# EAGLE schematic Arduino robot (EAGLE 9.4.2)
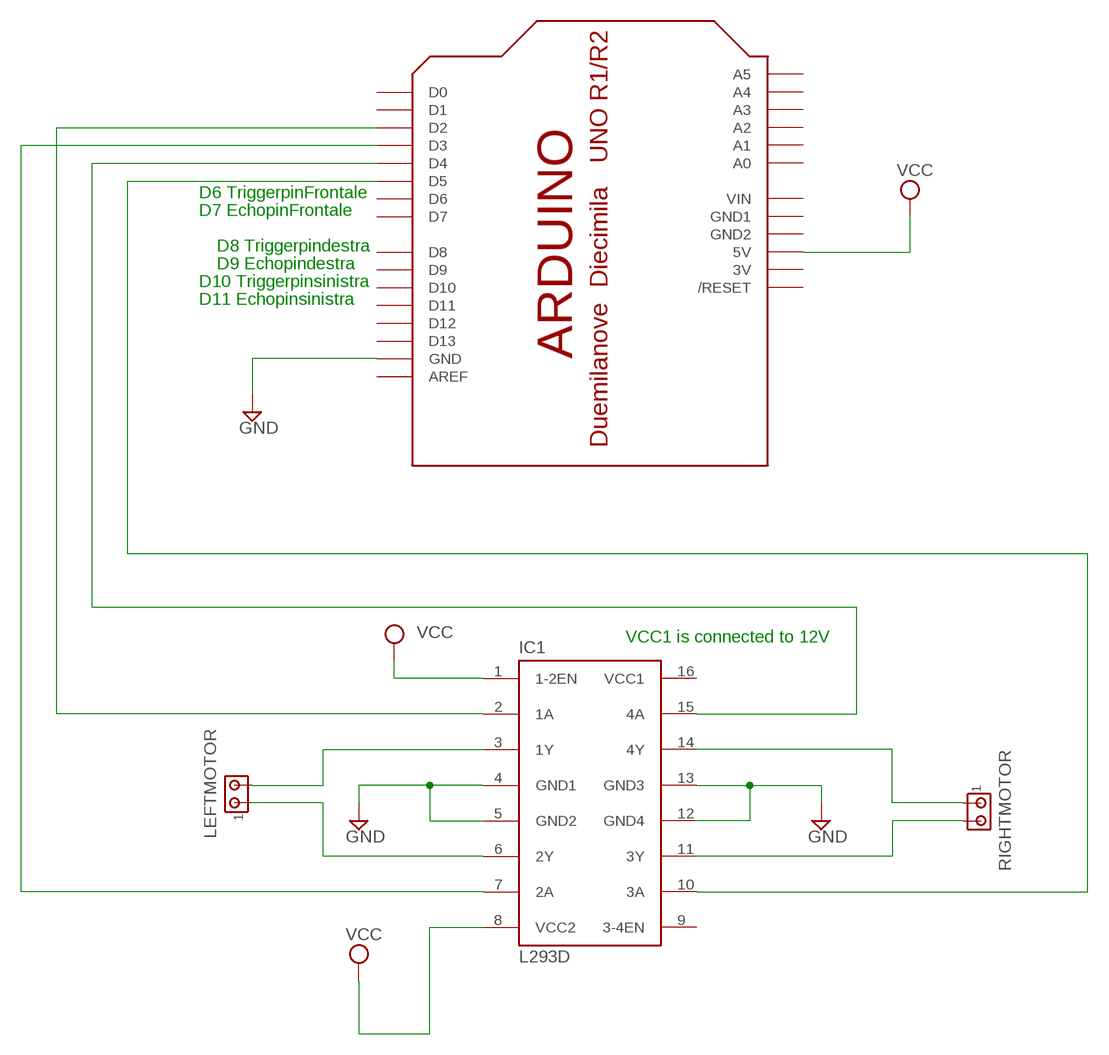
[diagram p0: schematic, sheet 1]

## Parts
IC1  L293D  [DIL16]
LEFTMOTOR  MTA02-156  [1X2MTA]
RIGHTMOTOR  MTA02-156  [1X2MTA]
U$1  ARDUINO-NOHOLE  [ARDUINO-NOHOLE]

## Nets
GND: IC1.4(GND1) IC1.5(GND2) IC1.12(GND4) IC1.13(GND3) U$1.GND
N$1: IC1.3(1Y) LEFTMOTOR.2
N$2: IC1.6(2Y) LEFTMOTOR.1
N$3: IC1.14(4Y) RIGHTMOTOR.1
N$4: IC1.11(3Y) RIGHTMOTOR.2
N$5: IC1.15(4A) U$1.D4
N$6: IC1.2(1A) U$1.D2
N$7: IC1.7(2A) U$1.D3
N$8: IC1.10(3A) U$1.D5
VCC: IC1.1(1-2EN) IC1.8(VCC2) U$1.5V
Unconnected: IC1.9(3-4EN) U$1.A0 U$1.A1 U$1.A2 U$1.A3 U$1.A4 U$1.A5 U$1.AREF U$1.D0 U$1.D1 U$1.D6 U$1.D7 U$1.D8 U$1.D9 U$1.D10 U$1.D11 U$1.D12 U$1.D13 U$1.RESET(/RESET)

## Notes on the sheet
- D6 TriggerpinFrontale
- D7 EchopinFrontale
- D8 Triggerpindestra
- D9 Echopindestra
- D10 Triggerpinsinistra
- D11 Echopinsinistra
- VCC1 is connected to 12V

## Power pins joined to a net without a drawn wire
3V: U$1.3V
GND1: U$1.GND1
GND2: U$1.GND2
VCC1: IC1.16(VCC1)
VIN: U$1.VIN

## Library data of the parts
IC1 = st-microelectronics:L293D: PUSH-PULL 4 CHANNEL DRIVER; MPN: L293D; OC_FARNELL: 9589619; OC_NEWARK: 56P8249
LEFTMOTOR RIGHTMOTOR = con-amp:MTA02-156: AMP connector
U$1 = adafruit:ARDUINO: Arduino Diecimila/Duemilanove Make a shield with ease, this package has all the named pins as well as the two mounting drill holes and an outline of the USB and DC power connector. The outline is on the DIMENSION layer, so if your board house uses it they will cut the outline to match. http://www.ladyada.net/library/pcb/eaglelibrary.html